# EAGLE design BeatDetect (EAGLE 6.4)
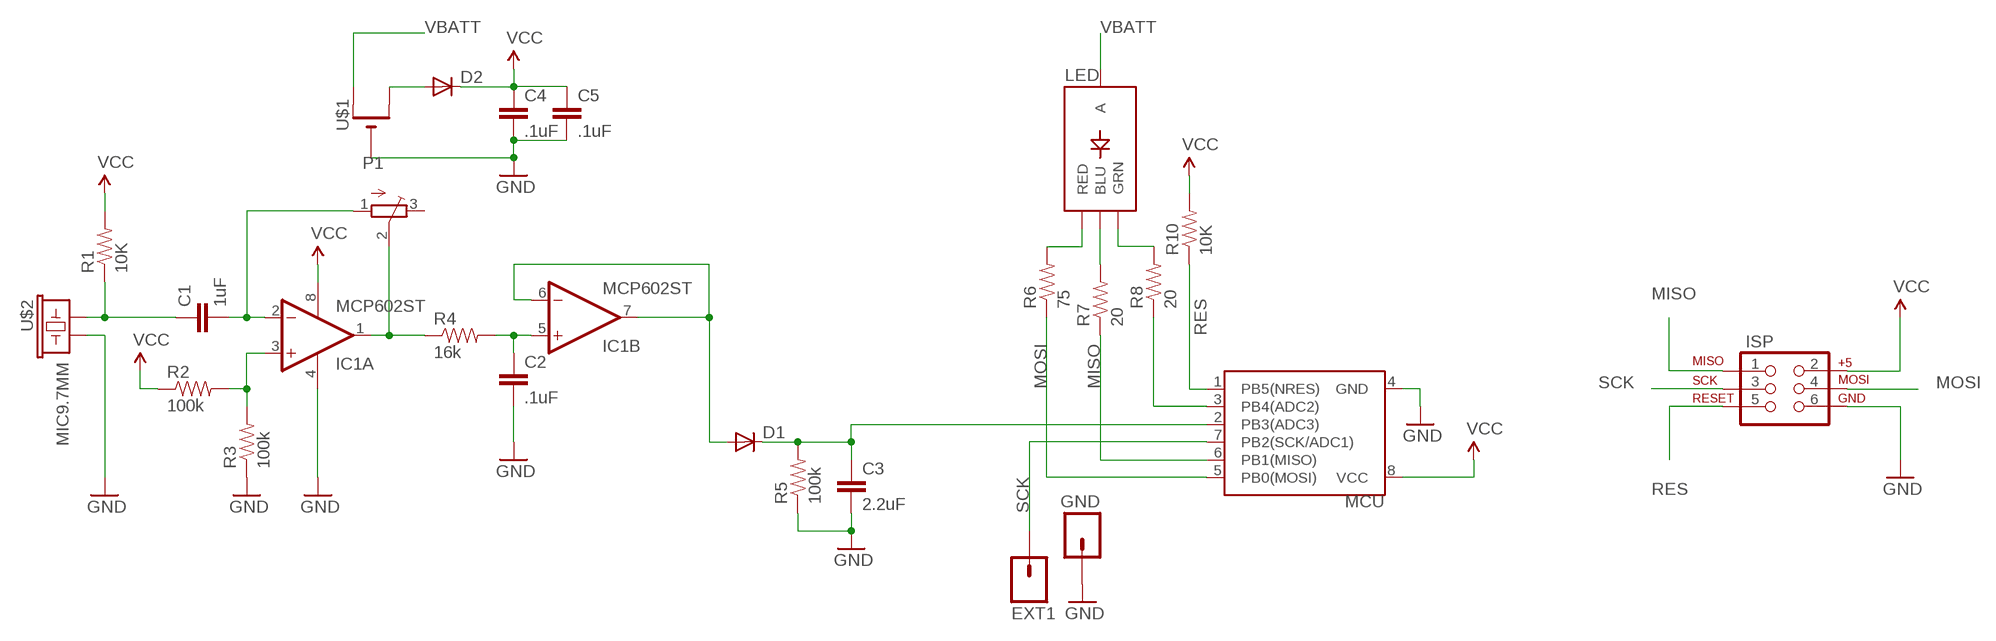
[diagram p0: schematic, sheet 1]

## Parts
C1  1uF  CAP0805  [0805]
C2  .1uF  CAP0603-CAP  [0603-CAP]
C3  2.2uF  CAP0805  [0805]
C4  .1uF  CAP0603-CAP  [0603-CAP]
C5  .1uF  CAP0603-CAP  [0603-CAP]
D1  DIODESOD  [SOD-323]
D2  DIODESOD  [SOD-323]
EXT1  M01PTH  [1X01]
GND  M01PTH  [1X01]
IC1  MCP602ST  [TSSOP8]
ISP  AVR_SPI_PRG_6PTH  [2X3]
LED  LED-TRICOLORPLCC4  [LED-PLCC4]
MCU  ATTINY45X  [TSSOP8]
P1  TRIMPOTTC33X  [TC33X]
R1  10K  RESISTOR0402-RES  [0402-RES]
R2  100k  RESISTOR0402-RES  [0402-RES]
R3  100k  RESISTOR0402-RES  [0402-RES]
R4  16k  RESISTOR0402-RES  [0402-RES]
R5  100k  RESISTOR0402-RES  [0402-RES]
R6  75  RESISTOR0805-RES  [0805]
R7  20  RESISTOR0402-RES  [0402-RES]
R8  20  RESISTOR0402-RES  [0402-RES]
R10  10K  RESISTOR0402-RES  [0402-RES]
U$1  CR2032SMT  [CR2032-SMD]
U$2  MIC9.7MM  [MIC-9.7MM]

## Nets
GND: C2.2 C3.2 C4.2 C5.2 GND.1 IC1.4(P:V-) ISP.6 MCU.4(GND) R3.1 R5.1 U$1.- U$2.2
MISO: ISP.1 MCU.6(PB1(MISO)) R7.1
MOSI: ISP.4 MCU.5(PB0(MOSI)) R6.1
N$1: D1.2(A) IC1.6(B:-IN) IC1.7(B:OUT)
N$2: C2.1 IC1.5(B:+IN) R4.2
N$3: IC1.1(A:OUT) P1.2(S) R4.1
N$4: C1.1 R1.1 U$2.1
N$5: C1.2 IC1.2(A:-IN) P1.1(A)
N$6: IC1.3(A:+IN) R2.2 R3.2
N$7: D2.2(A) U$1.+$2(+1)
N$9: MCU.3(PB4(ADC2)) R8.1
N$11: LED.R(RED) R6.2
N$12: LED.G(GRN) R8.2
N$13: LED.B(BLU) R7.2
N$7687: C3.1 D1.1(C) MCU.2(PB3(ADC3)) R5.2
RES: ISP.5 MCU.1(PB5(NRES)) R10.1
SCK: EXT1.1 ISP.3 MCU.7(PB2(SCK/ADC1))
VBATT: LED.A U$1.+$1(+)
VCC: C4.1 C5.1 D2.1(C) IC1.8(P:V+) ISP.2 MCU.8(VCC) R1.2 R2.1 R10.2
Unconnected: P1.3(E)

## Library data of the parts
C1 C2 = SparkFun-Passives:CAP: Capacitor Standard 0603 ceramic capacitor, and 0.1" leaded capacitor.
C3-C5 = SparkFun-Capacitors:CAP: Capacitor Standard 0603 ceramic capacitor, and 0.1" leaded capacitor.
D1 D2 = SparkFun-DiscreteSemi:DIODE: Diode These are standard reverse protection diodes and small signal diodes. SMA package can handle up to about 1A. SOD-323 can handle about 200mA. What the SOD-323 package when ordering, there are some mfgs out there that are 5-pin packages.
EXT1 GND = SparkFun-Connectors:M01: Header 1 Standard 1-pin 0.1" header. Use with straight break away headers (SKU : PRT-00116), right angle break away headers (PRT-00553), swiss pins (PRT-00743), machine pins (PRT-00117), and female headers (PRT-00115).
IC1 = linear:MCP602: Single Op Amp 2.7V to 6.0V Single Supply CMOS Source: http://ww1.microchip.com/downloads/en/DeviceDoc/21314g.pdf
ISP = SparkFun-Connectors:AVR_SPI_PRG_6: AVR ISP 6 Pin This is the reduced ISP connector for AVR programming. Common on Arduino. This footprint will take up less PCB space and can be used with a 10-pin to 6-pin adapter such as SKU: BOB-08508
LED = SparkFun-LED:LED-TRICOLOR: Tri-Color LED SMD Proven layout and schematic for triple color LED in SMD package - common anode. Spark Fun Electronics SKU : COM-07844
MCU = SparkFun-DigitalIC:ATTINY45: Atmel 8-pin 2/4/8kB flash uC
P1 = adafruit:TRIMPOT: SMT trimmer potentiometer part number TC33X http://www.ladyada.net/library/eagle
R1-R8 R10 = SparkFun-Passives:RESISTOR: Resistor Basic schematic elements and footprints for 0603, 1206, and PTH resistors.
U$1 = adafruit:CR2032
U$2 = SparkFun-Sensors:MIC: Omni-directional electret microphone. 9.7mm standard diameter.

## Board
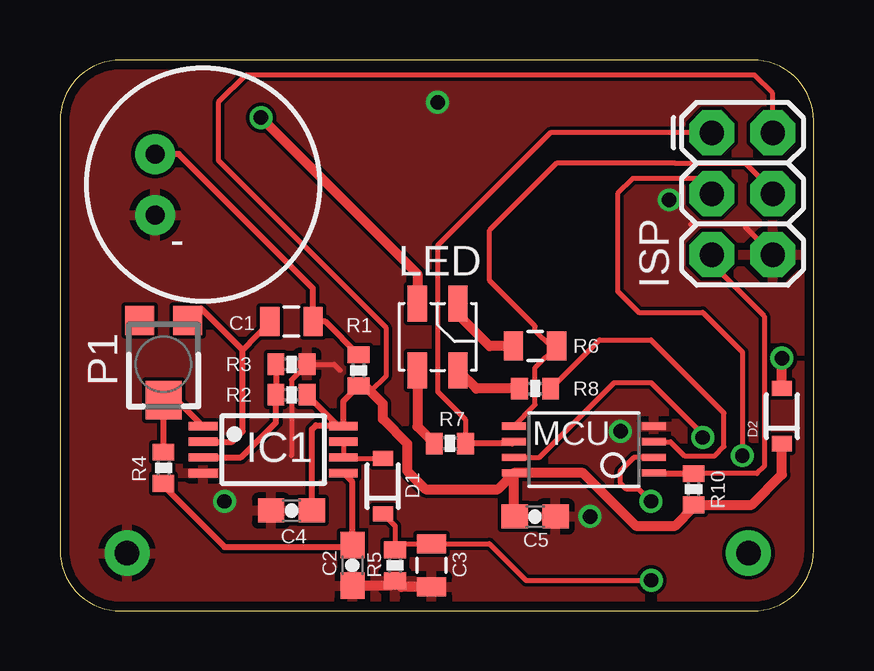
[diagram p1: board, top side]
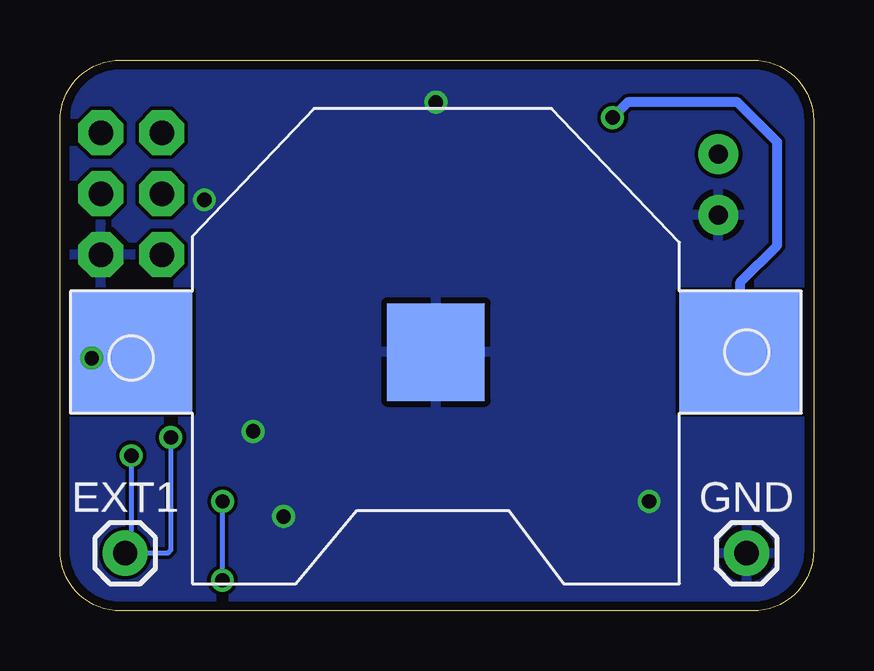
[diagram p2: board, bottom side, seen from below]

Size 31.42 x 22.98 mm. Coordinates in mm from the lower left corner, seen from the top.
Outline: 0,20.44 0,2.54 arc90 2.54,0 28.88,0 arc90 31.42,2.54 31.42,20.44 arc90 28.88,22.98 2.54,22.98 arc90 0,20.44
Copper layers (1*16): Top 0.0356mm / dielectric 1.5011mm / Bottom 0.0356mm
Design rules "LaenPCBOrder": minimum track width 6mil, minimum drill 13mil, track to track 6mil, track to pad 6mil, pad to pad 6mil, via to via 6mil, smd to smd 6mil, copper to edge 15mil, drill to drill 6mil, minimum pad ring 7mil, minimum via ring 7mil, stop-mask expansion 4mil, vias tented up to drill 0mil, thermal gap 10mil

### Footprints (pad centres in the part's own frame; a part is rotated, then mirrored left to right if it is on the bottom)
0805 = smd 0.8 x 1.2: 1 -0.9,0; 2 0.9,0
0603-CAP = smd 1.1 x 1: 1 -0.85,0; 2 0.85,0
SOD-323 = smd 0.63 x 0.83: 1 -1.15,0; 2 1.15,0
1X01 = drill 1.016 pad 1.88: 1 0,0
TSSOP8 = smd 0.35 x 1.2: 1 -0.975,-2.925; 2 -0.325,-2.925; 3 0.325,-2.925; 4 0.975,-2.925; 5 0.975,2.925; 6 0.325,2.925; 7 -0.325,2.925; 8 -0.975,2.925
2X3 = drill 1.016 pad 1.88 octagon: 1 0,0; 2 0,2.54; 3 2.54,0; 4 2.54,2.54; 5 5.08,0; 6 5.08,2.54
LED-PLCC4 = smd 0.8 x 1.5: A 0.85,-1.4; B 0.85,1.4; G -0.85,1.4; R -0.85,-1.4
TSSOP8' = smd 0.305 x 0.991: 1 -0.975,-2.918; 2 -0.325,-2.918; 3 0.325,-2.918; 4 0.975,-2.918; 5 0.975,2.918; 6 0.325,2.918; 7 -0.325,2.918; 8 -0.975,2.918
TC33X = smd 1.2 x 1.2: 1 -1,-1.825; 3 1,-1.825 | smd 1.5 x 1.6: 2 0,1.5
0402-RES = smd 0.7 x 0.9: 1 -0.65,0; 2 0.65,0
CR2032-SMD = smd 5.08 x 5.08: +$1 -12.7,0; +$2 12.7,0 | smd 4.064 x 4.064: - 0,0
MIC-9.7MM = drill 0.8 pad 1.676: 1 -2,1.27; 2 -2,-1.27

### Placement (x,y rotation side)
C1  9.65,12.06 180 top
C2  12.19,1.91 270 top
C3  15.49,1.91 270 top
C4  9.65,4.19 180 top
C5  19.81,3.94 0 top
D1  13.46,5.21 90 top
D2  30.1,8.13 90 top
EXT1  28.7,2.41 0 bottom
GND  2.79,2.41 0 bottom
IC1  8.89,6.73 270 top
ISP  27.18,19.94 270 top
LED  15.75,11.43 180 top
MCU  [TSSOP8']  21.84,6.73 90 top
P1  4.32,10.29 180 top
R1  12.45,10.03 270 top
R2  9.65,9.02 180 top
R3  9.65,10.29 180 top
R4  4.32,5.97 270 top
R5  13.97,1.91 90 top
R6  19.81,11.05 180 top
R7  16.26,6.99 180 top
R8  19.81,9.27 180 top
R10  26.42,5.08 270 top
U$1  15.75,10.79 180 bottom
U$2  5.97,17.78 0 top

### Tracks (layer width: path | path; a pad name or v marks a point on that pad's centre or on a via)
GND  (via drill 0.6)
  Top 0.203: 9.65,6.48 9.65,9.64 R3.1 11.43,10.29 11.68,10.03 | ISP.6 28.57,16 28.57,16.13 26.29,16.13
  Top 0.406: C2.2 13.77,1.05 R5.1 14.22,1 C3.2
  other vias: 6.86,4.57 15.75,21.21 23.37,7.49 25.4,17.14 22.1,3.94
  pour Top: 1.27,0 0,0 0,46.99 53.34,46.99 53.34,0
  pour Bottom: -3.3,-2.54 -6.6,-2.54 -6.6,87.63 124.46,87.63 124.46,80.77 124.71,80.77 124.71,-3.56 12.7,-3.56 12.7,-5.84
MISO
  Top 0.203: ISP.1 20.45,19.94 15.75,15.24 15.75,9.14 16.91,7.99 R7.1
  Top 0.254: MCU.6 18.86,6.99 R7.1
MOSI
  Top 0.203: MCU.5 19.81,8.59 19.81,10.15 R6.1 20.46,11.03 19.81,11.68 19.81,11.88 18.73,12.95 17.91,13.78 17.91,15.88 20.7,18.67 25.65,18.67 28.57,18.67 29.72,17.53 ISP.4
N$1
  Top 0.203: IC1.7 IC1.6 11.86,6.36 D1.2
N$2
  Top 0.254: IC1.5 12.19,5.38 C2.1 12.1,2.67 6.86,2.67 4.32,5.21 R4.2
N$3
  Top 0.254: R4.1 P1.2 4.88,8.79 IC1.1
N$4
  Top 0.254: R1.1 11.06,12.06 C1.1 10.54,12.1 10.54,13.46 4.95,19.05 U$2.1
N$5
  Top 0.254: IC1.2 7.18,7.06 7.62,7.49 7.62,10.88 | 7.62,10.88 C1.2 | 7.62,10.88 5.88,12.62 P1.1
N$6
  Top 0.254: R3.2 R2.2 9,7.86 7.55,6.41 IC1.3
N$7  (via drill 0.6)
  Top 0.406: D2.2 v30.1,10.54
  Bottom 0.406: U$1.+$2 29.08,10.16 29.72,10.16 v30.1,10.54
N$9
  Top 0.203: R8.1 22.49,11.3 24.64,11.3 27.69,8.26 27.69,6.86 27.3,6.48 26.04,6.48 25.46,7.06 MCU.3
N$11
  Top 0.406: R6.2 17.91,11.05 16.6,12.36 LED.R
N$12
  Top 0.406: R8.2 17.36,9.27 LED.G
N$13
  Top 0.406: 15.41,7.18 R7.2 14.9,7.69 LED.B
N$7687  (via drill 0.6)
  Top 0.203: MCU.2 23.93,6.41 23.37,5.84 23.37,5.33 23.62,5.08 24.13,5.08 v24.64,4.57 | D1.1 13.97,3.55 R5.2 14.22,2.81 C3.1 17.9,2.81 19.43,1.27 24.64,1.27 v24.65,1.28
  Bottom 0.203: v24.65,1.28 24.64,1.29 v24.64,4.57
RES
  Top 0.203: R10.1 29.06,5.73 29.36,6.03 29.36,12.3 27.18,14.48 ISP.5
  Top 0.254: MCU.1 24.79,5.73 R10.1
SCK  (via drill 0.6)
  Top 0.203: ISP.3 26.54,18.03 23.88,18.03 23.24,17.4 23.24,13.34 24.13,12.45 26.8,12.45 28.45,10.79 v28.45,6.48 | MCU.7 20,6.41 23.11,9.53 24.64,9.53 26.8,7.37 v26.8,7.24
  Bottom 0.203: v28.45,6.48 28.45,2.67 EXT1.1 26.92,2.41 26.8,2.54 v26.8,7.24
VBATT  (via drill 0.6)
  Top 0.406: v8.38,20.57 14.9,14.06 LED.A
  Bottom 0.406: U$1.+$1 3.05,13.72 1.52,15.24 1.52,19.56 3.17,21.21 7.75,21.21 v8.38,20.57
VCC
  Top 0.203: ISP.2 29.72,21.59 28.96,22.35 7.75,22.35 6.6,21.21 6.6,18.8 13.59,11.81 13.59,9.78 12.95,9.14
  Top 0.254: C4.1 10.5,7.58 10.67,7.75 11.77,7.75 IC1.8 | IC1.8 11.61,7.71 R2.1 | IC1.8 11.81,8.75 R1.2 | C5.1 18.93,3.97
  Top 0.406: 18.93,3.97 MCU.8 | MCU.8 21.8,5.76 24,3.56 25.65,3.56 26.42,4.32 R10.2 28.83,4.43 30.1,5.7 D2.1 | MCU.8 18.25,5.08 15.24,5.08 14.48,5.84 14.48,6.99 13.46,8 13.46,8.64 12.95,9.14 12.71,9.38 R1.2